# EAGLE design starTrekChair (EAGLE 6.6.0)
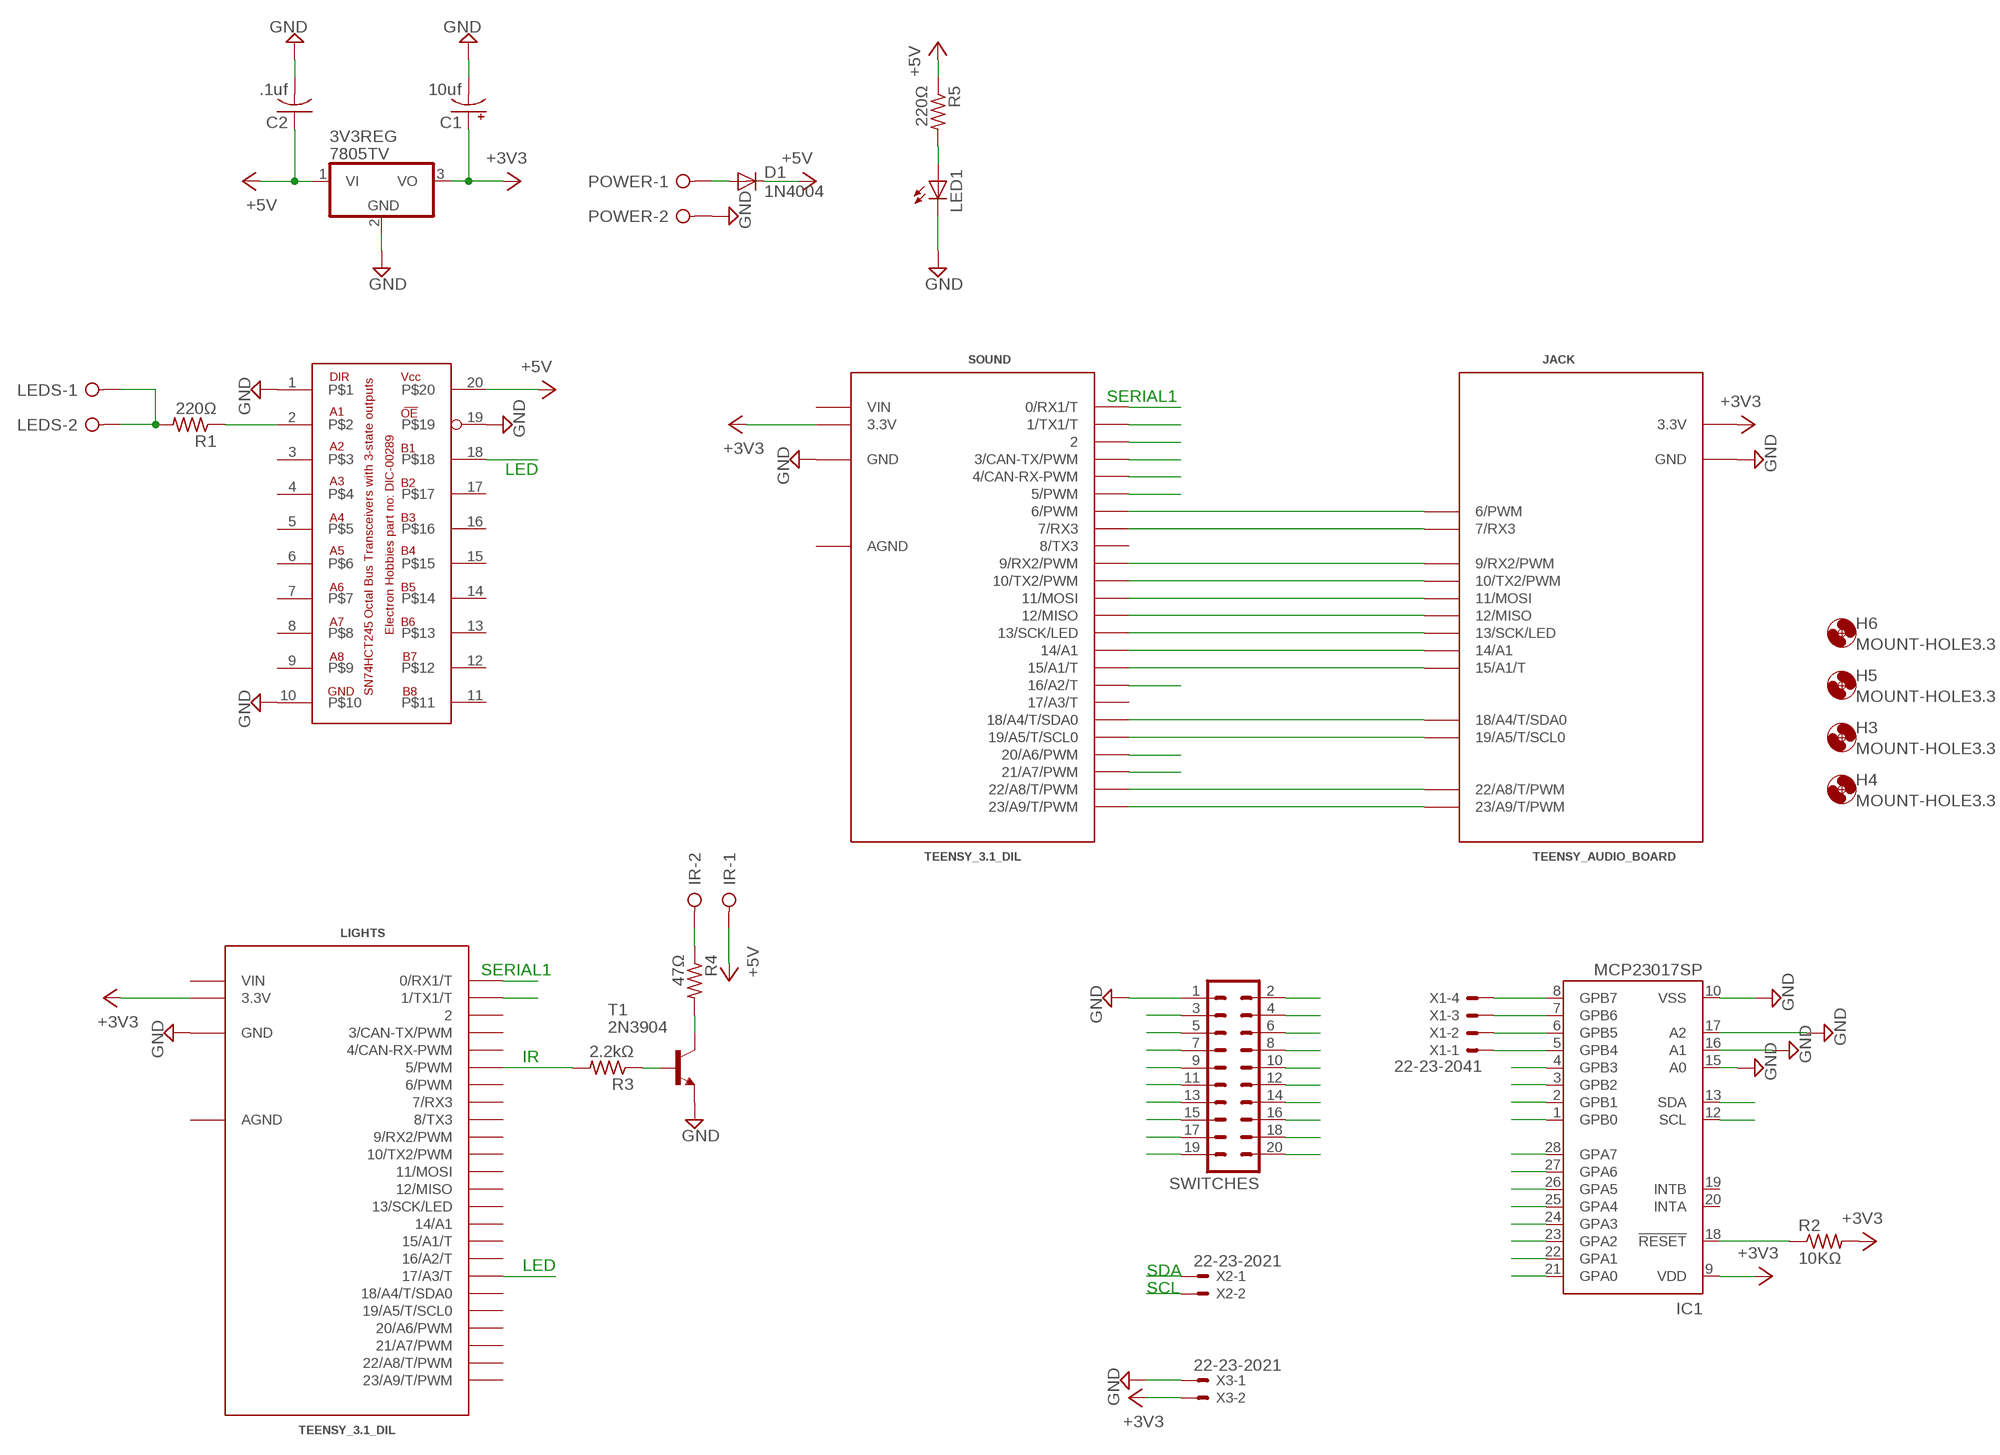
[diagram p0: schematic, sheet 1]

## Parts
3V3REG  7805TV  [TO220V]
C1  10uf  CPOL-USE2-4  [E2-4]
C2  .1uf  C-US050-025X075  [C050-025X075]
D1  1N4004  [DO41-10]
H3  MOUNT-HOLE3.3  [3,3]
H4  MOUNT-HOLE3.3  [3,3]
H5  MOUNT-HOLE3.3  [3,3]
H6  MOUNT-HOLE3.3  [3,3]
IC1  MCP23017SP  [DIL28-3]
IR  W237-02P  [W237-132]
JACK  TEENSY_AUDIO_BOARD  [TEENSY_AUDIO_BOARD]
LED1  LED5MM  [LED5MM]
LEDS  W237-02P  [W237-132]
LIGHTS  TEENSY_3.1_DIL  [TEENSY3-DIL]
POWER  W237-02P  [W237-132]
R1  220Ω  R-US_0207/10  [0207/10]
R2  10KΩ  R-US_0207/10  [0207/10]
R3  2.2kΩ  R-US_0207/10  [0207/10]
R4  47Ω  R-US_0207/10  [0207/10]
R5  220Ω  R-US_0207/10  [0207/10]
SOUND  TEENSY_3.1_DIL  [TEENSY3-DIL]
SWITCHES  ML20  [ML20]
T1  2N3904  [TO92]
U$1  SN74HCT245DIL20  [DIL20]
X1  22-23-2041  [22-23-2041]
X2  22-23-2021  [22-23-2021]
X3  22-23-2021  [22-23-2021]

## Nets
+3V3 [3V3]: 3V3REG.3(VO) C1.+ IC1.9(VDD) JACK.3.3V LIGHTS.3.3V R2.2 SOUND.3.3V X3.2
+5V [+5V]: 3V3REG.1(VI) C2.1 D1.C IR.1 R5.1 U$1.20
GND [GND]: 3V3REG.2(GND) C1.- C2.2 IC1.10(VSS) IC1.15(A0) IC1.16(A1) IC1.17(A2) JACK.GND LED1.K(C) LIGHTS.GND POWER.2 SOUND.GND SWITCHES.1 T1.3(E) U$1.1 U$1.10 U$1.19 X3.1
LED: LIGHTS.17/A3(17/A3/T) U$1.18
N$1: JACK.6(6/PWM) SOUND.6(6/PWM)
N$2: JACK.7(7/RX3) SOUND.7(7/RX3)
N$3: JACK.12(12/MISO) SOUND.12(12/MISO)
N$4: JACK.11(11/MOSI) SOUND.11(11/MOSI)
N$5: JACK.10(10/TX2/PWM) SOUND.10(10/TX2/PWM)
N$6: JACK.9(9/RX2/PWM) SOUND.9(9/RX2/PWM)
N$7: JACK.23/A9(23/A9/T/PWM) SOUND.23/A9(23/A9/T/PWM)
N$8: JACK.22/A8(22/A8/T/PWM) SOUND.22/A8(22/A8/T/PWM)
N$9: IC1.18(!RESET) R2.1
N$10: LIGHTS.5(5/PWM) R3.2
N$11: JACK.15/A1(15/A1/T) SOUND.15/A1(15/A1/T)
N$12: JACK.14/A0(14/A1) SOUND.14/A0(14/A1)
N$13: JACK.13(13/SCK/LED) SOUND.13(13/SCK/LED)
N$14: R1.1 U$1.2
N$15: LEDS.1 LEDS.2 R1.2
N$16: IR.2 R4.1
N$17: R4.2 T1.1(C)
N$18: IC1.5(GPB4) X1.1
N$19: IC1.6(GPB5) X1.2
N$20: IC1.7(GPB6) X1.3
N$21: IC1.8(GPB7) X1.4
N$22: R3.1 T1.2(B)
N$23 [+5V]: LED1.A R5.2
N$24 [+5V]: D1.A POWER.1
RIBBON2: SOUND.2 SWITCHES.2
RIBBON3: SOUND.3(3/CAN-TX/PWM) SWITCHES.3
RIBBON4: SOUND.4(4/CAN-RX-PWM) SWITCHES.4
RIBBON5: SOUND.5(5/PWM) SWITCHES.5
RIBBON6: SOUND.16/A2(16/A2/T) SWITCHES.6
RIBBON7: SOUND.20/A6(20/A6/PWM) SWITCHES.7
RIBBON8: SOUND.21/A7(21/A7/PWM) SWITCHES.8
RIBBON9: IC1.21(GPA0) SWITCHES.9
RIBBON10: IC1.22(GPA1) SWITCHES.10
RIBBON11: IC1.23(GPA2) SWITCHES.11
RIBBON12: IC1.24(GPA3) SWITCHES.12
RIBBON13: IC1.25(GPA4) SWITCHES.13
RIBBON14: IC1.26(GPA5) SWITCHES.14
RIBBON15: IC1.27(GPA6) SWITCHES.15
RIBBON16: IC1.28(GPA7) SWITCHES.16
RIBBON17: IC1.1(GPB0) SWITCHES.17
RIBBON18: IC1.2(GPB1) SWITCHES.18
RIBBON19: IC1.3(GPB2) SWITCHES.19
RIBBON20: IC1.4(GPB3) SWITCHES.20
S_RX: LIGHTS.1(1/TX1/T) SOUND.0(0/RX1/T)
S_TX: LIGHTS.0(0/RX1/T) SOUND.1(1/TX1/T)
SCL: IC1.12(SCL) JACK.19/A5(19/A5/T/SCL0) SOUND.19/A5(19/A5/T/SCL0) X2.2
SDA: IC1.13(SDA) JACK.18/A4(18/A4/T/SDA0) SOUND.18/A4(18/A4/T/SDA0) X2.1
Unconnected: IC1.19(INTB) IC1.20(INTA) LIGHTS.2 LIGHTS.3(3/CAN-TX/PWM) LIGHTS.4(4/CAN-RX-PWM) LIGHTS.6(6/PWM) LIGHTS.7(7/RX3) LIGHTS.8(8/TX3) LIGHTS.9(9/RX2/PWM) LIGHTS.10(10/TX2/PWM) LIGHTS.11(11/MOSI) LIGHTS.12(12/MISO) LIGHTS.13(13/SCK/LED) LIGHTS.14/A0(14/A1) LIGHTS.15/A1(15/A1/T) LIGHTS.16/A2(16/A2/T) LIGHTS.18/A4(18/A4/T/SDA0) LIGHTS.19/A5(19/A5/T/SCL0) LIGHTS.20/A6(20/A6/PWM) LIGHTS.21/A7(21/A7/PWM) LIGHTS.22/A8(22/A8/T/PWM) LIGHTS.23/A9(23/A9/T/PWM) SOUND.8(8/TX3) SOUND.17/A3(17/A3/T) U$1.3 U$1.4 U$1.5 U$1.6 U$1.7 U$1.8 U$1.9 U$1.11 U$1.12 U$1.13 U$1.14 U$1.15 U$1.16 U$1.17

## Notes on the sheet
- SERIAL1
- LED
- SERIAL1
- IR
- LED
- SDA
- SCL

## Power pins joined to a net without a drawn wire
AGND: LIGHTS.AGND SOUND.AGND
VIN: LIGHTS.VIN SOUND.VIN

## Library data of the parts
3V3REG = linear:78*: Positive VOLTAGE REGULATOR Source: http://cache.national.com/ds/LM/LM78L05.pdf http://www.fairchildsemi.com/ds/LM/LM7805.pdf
C1 = adafruit:CPOL-US: POLARIZED CAPACITOR, American symbol
C2 = adafruit:C-US: CAPACITOR, American symbol
D1 = adafruit:1N4004: DIODE General purpose 1N400x type rectifier (With bigger pads) http://www.ladyada.net/library/pcb/eaglelibrary.html
H3-H6 = holes:MOUNT-HOLE: MOUNTING HOLE with drill center marker
IC1 = adafruit:MCP23017: http://ww1.microchip.com/downloads/en/DeviceDoc/21952a.pdf Source: http://ww1.microchip.com/downloads/en/DeviceDoc/21952a.pdf
IR LEDS POWER = con-wago-508:W237-02P: WAGO SREW CLAMP; OC_FARNELL: unknown; OC_NEWARK: unknown
JACK = Teensy_3_and_LC_Series_Boards_v1.1:TEENSY_AUDIO_BOARD: Teensy Audio Board (Shared pins only)
LED1 = adafruit:LED: LED OSRAM: - CHIPLED LG R971, LG N971, LY N971, LG Q971, LY Q971, LO R971, LY R971 LH N974, LH R974 LS Q976, LO Q976, LY Q976 LO Q996 - Hyper CHIPLED LW Q18S LB Q993, LB Q99A, LB R99A - SideLED LS A670, LO A670, LY A670, LG A670, LP A670 LB A673, LV A673, LT A673, LW A673 LH A674 LY A675 LS A676, LA A676, LO A676, LY A676, LW A676 LS A679, LY A679, LG A679 - Hyper Micro SIDELED® LS Y876, LA Y876, LO Y876, LY Y876 LT Y87S - SmartLED LW L88C, LW L88S LB L89C, LB L89S, LG L890 LS L89K, LO L89K, LY L89K LS L896, LA L896, LO L896, LY L896 - TOPLED LS T670, LO T670, LY T670, LG T670, LP T670 LSG T670, LSP T670, LSY T670, LOP T670, LYG T670 LG T671, LOG T671, LSG T671 LB T673, LV T673, LT T673, LW T673 LH T674 LS T676, LA T676, LO T676, LY T676, LB T676, LH T676, LSB T676, LW T676 LB T67C, LV T67C, LT T67C, LS T67K, LO T67K, LY T67K, LW E67C LS E67B, LA E67B, LO E67B, LY E67B, LB E67C, LV E67C, LT E67C LW T67C LS T679, LY T679, LG T679 LS T770, LO T770, LY T770, LG T770, LP T770 LB T773, LV T773, LT T773, LW T773 LH T774 LS E675, LA E675, LY E675, LS T675 LS T776, LA T776, LO T776, LY T776, LB T776 LHGB T686 LT T68C, LB T68C - Hyper Mini TOPLED® LB M676 - Mini TOPLED Santana® LG M470 LS M47K, LO M47K, LY M47K Source: http://www.osram.convergy.de/
LIGHTS SOUND = Teensy_3_and_LC_Series_Boards_v1.1:TEENSY_3.1_DIL: Teensy 3.1 or 3.2 in a DIL Layout.
R1-R5 = adafruit:R-US_: RESISTOR, American symbol
SWITCHES = con-harting-ml:ML20: HARTING; OC_FARNELL: unknown; OC_NEWARK: unknown
T1 = transistor:2N3904: NPN TRANSISTOR
U$1 = EH DIC-00289 - SN74HCT245 OCTAL BUS TRANSCEIVERS WITH 3-STATE OUTPUTS:SN74HCT245: Electron Hobbies DIC-00289 SN74HCT245 Octal Bus Transceivers with 3-state outputs The SN74HCT245 octal bus transceivers are designed for asynchronous two-way communication between data buses. The control-function implementation minimizes external timing requirements. Ideal as an interface between 3.3V logic and the NeoPixel RGB LED's Re-order URL: http://electronhobbies.com/integrated-circuits-ic-s/289-sn74hct245-octal-bus-transceivers-with-3-state-outputs.html Manufacturer: Texas Instruments Manufacturer part number: SN74HCT245N Description: These octal bus transceivers are designed for asynchronous two-way communication between data buses. The control-function implementation minimizes external timing requirements. The ’HCT245 devices allow data transmission from the A bus to the B bus or from the B bus to the A bus, depending upon the logic level at the direction-control (DIR) input. The output-enable (OE) input can be used to disable the device so that the buses are effectively isolated. Features: Operating Voltage Range of 4.5V to 5.5V High Current 3-State Outputs drive bus lines directly or up to 15 LSTTL loads Low power consumption, 80uA Max Icc Typical tpd = 14ns +/- 6mA Output drive at 5V Low input current of 1uA max Inputs are TTL voltage compatible Package type: 20 pin PDIP Package marking SN74HCT245N
X1 = con-molex:22-23-2041: .100" (2.54mm) Center Header - 4 Pin; MF: MOLEX; MPN: 22-23-2041; OC_FARNELL: 1462920; OC_NEWARK: 38C0355
X2 X3 = con-molex:22-23-2021: .100" (2.54mm) Center Header - 2 Pin; MF: MOLEX; MPN: 22-23-2021; OC_FARNELL: 1462926; OC_NEWARK: 25C3832

## Net classes
1 GND: width 0.61 mm, clearance 0.305 mm
2 3V3: width 0.61 mm, clearance 0.305 mm
3 +5V: width 0.61 mm, clearance 0.305 mm

## Board
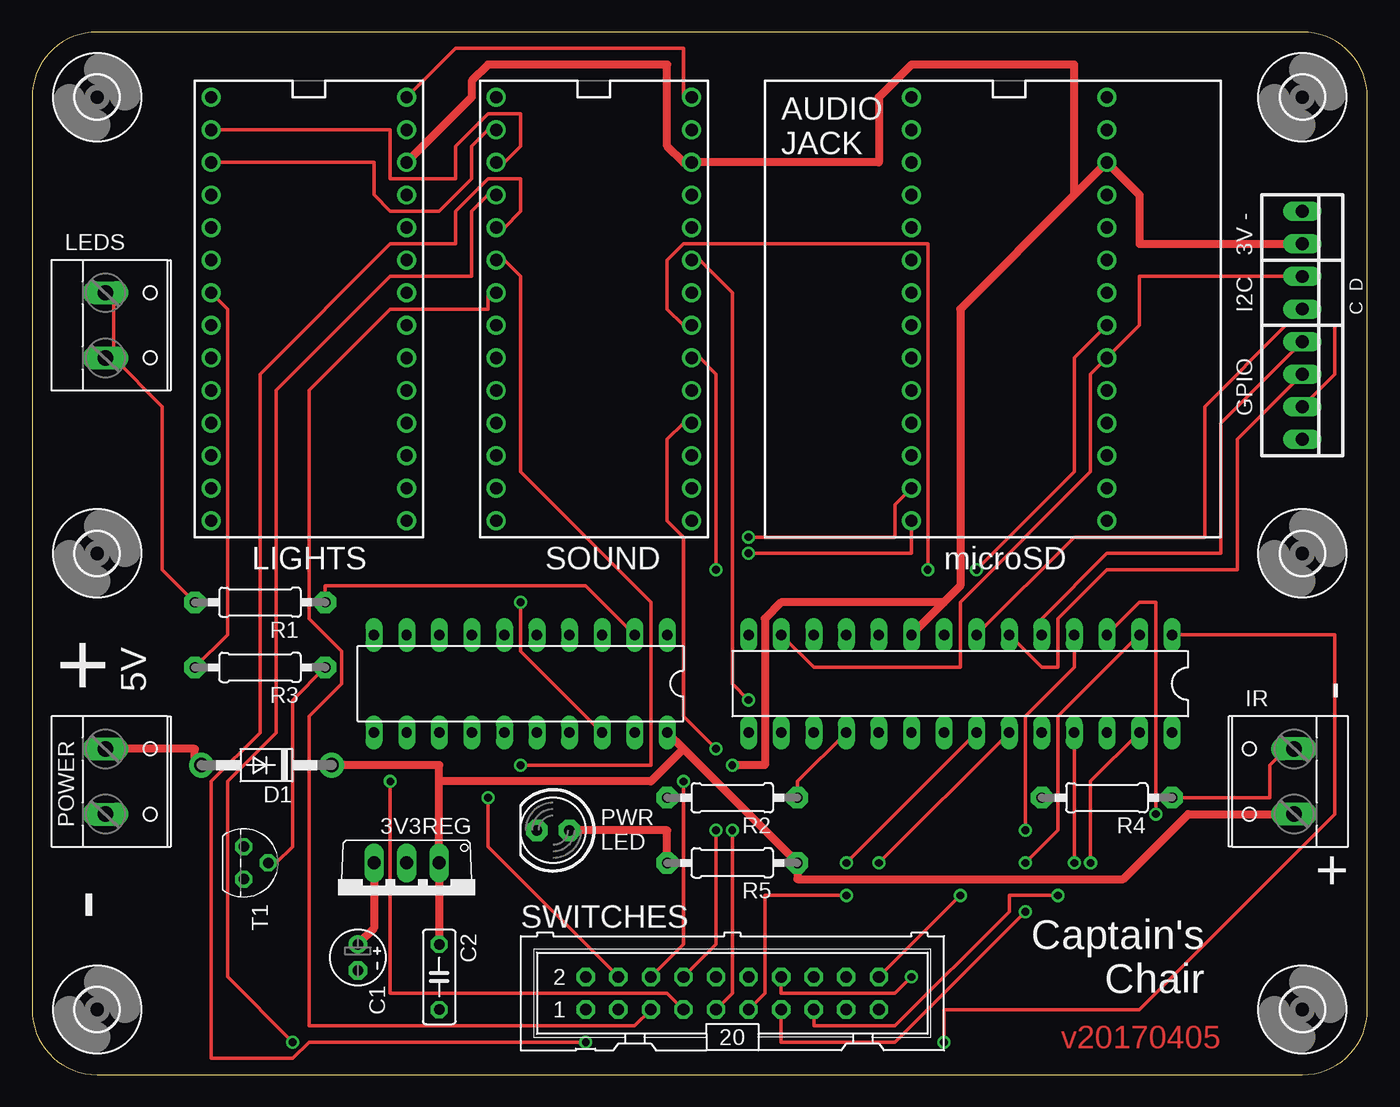
[diagram p1: board, top side]
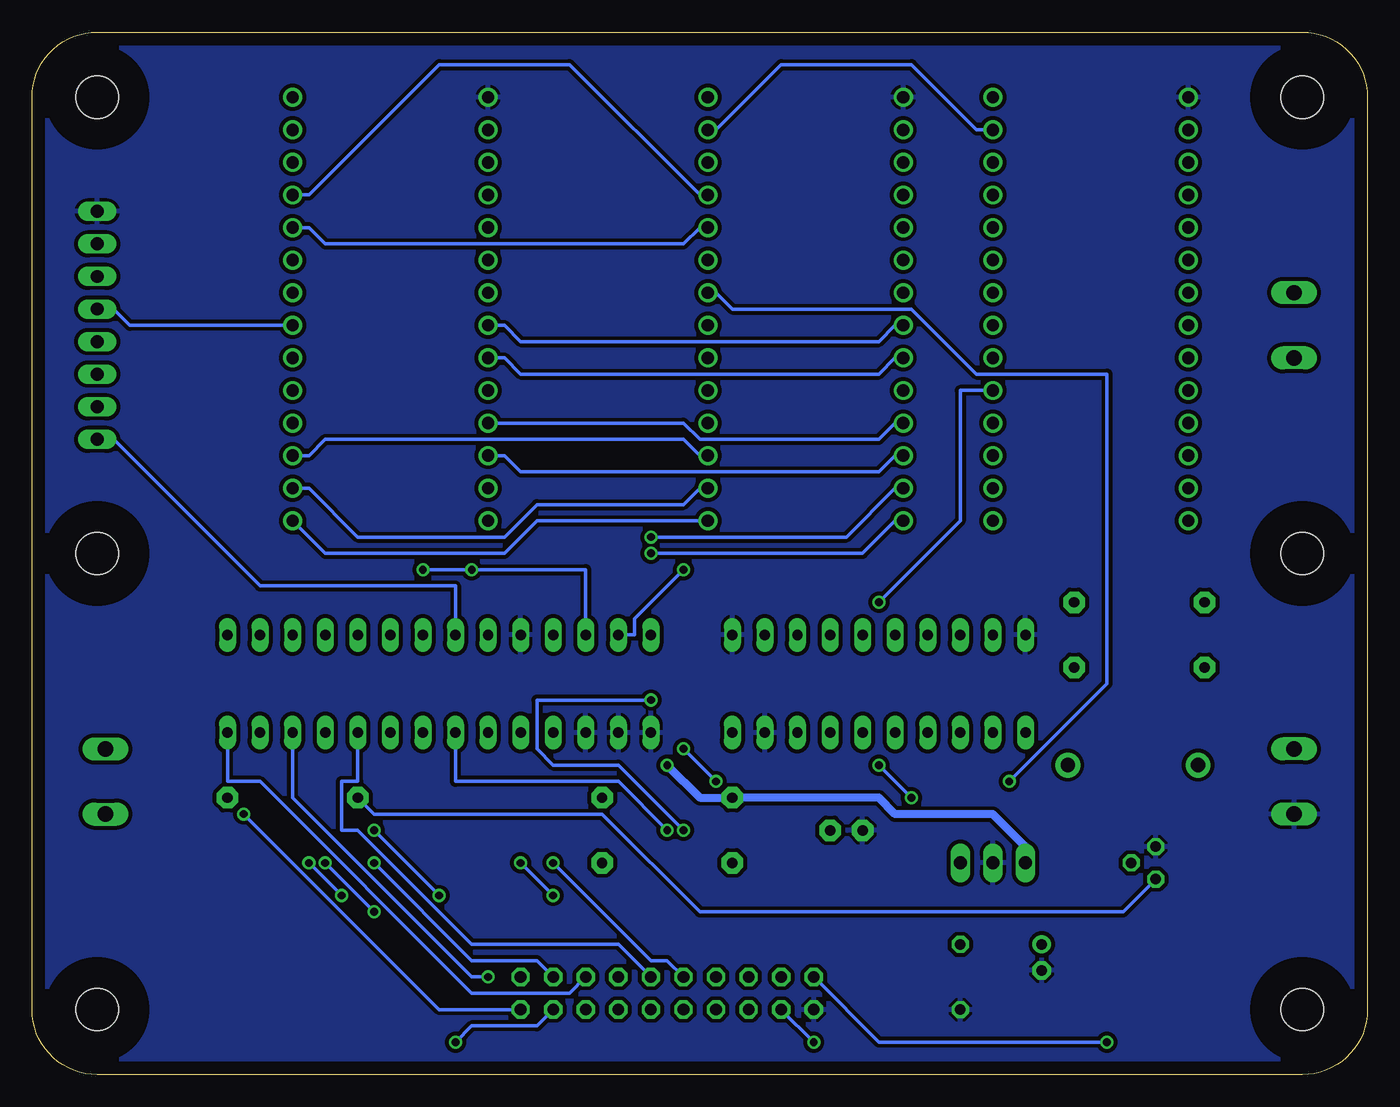
[diagram p2: board, bottom side, seen from below]

Size 104.14 x 81.28 mm. Coordinates in mm from the lower left corner, seen from the top.
Outline: 5.08,0 99.06,0 arc90 104.14,5.08 104.14,76.2 arc90 99.06,81.28 5.08,81.28 arc90 0,76.2 0,5.08 arc90 5.08,0
Copper layers (1*16): Top 0.035mm / dielectric 1.5mm / Bottom 0.035mm
Design rules "default": minimum track width 10mil, minimum drill 24mil, track to track 8mil, track to pad 8mil, pad to pad 8mil, via to via 8mil, smd to smd 8mil, copper to edge 40mil, drill to drill 8mil, minimum pad ring 10mil, minimum via ring 8mil, stop-mask expansion 4mil, vias tented up to drill 0mil, thermal gap 10mil

### Footprints (pad centres in the part's own frame; a part is rotated, then mirrored left to right if it is on the bottom)
TO220V = drill 1.016 long: 1 -2.54,-2.54; 2 0,-2.54; 3 2.54,-2.54
E2-4 = drill 0.813 pad 1.422: + -1.016,0 | drill 0.813 pad 1.422 octagon: - 1.016,0
C050-025X075 = drill 0.813 octagon: 1 -2.54,0; 2 2.54,0
DO41-10 = drill 1.118 pad 1.93: A 5.08,0; C -5.08,0
3,3 = hole 3.3: 0,0
DIL28-3 = drill 0.813 long: 1 -16.51,-3.81; 2 -13.97,-3.81; 3 -11.43,-3.81; 4 -8.89,-3.81; 5 -6.35,-3.81; 6 -3.81,-3.81; 7 -1.27,-3.81; 8 1.27,-3.81; 9 3.81,-3.81; 10 6.35,-3.81; 11 8.89,-3.81; 12 11.43,-3.81; 13 13.97,-3.81; 14 16.51,-3.81; 15 16.51,3.81; 16 13.97,3.81; 17 11.43,3.81; 18 8.89,3.81; 19 6.35,3.81; 20 3.81,3.81; 21 1.27,3.81; 22 -1.27,3.81; 23 -3.81,3.81; 24 -6.35,3.81; 25 -8.89,3.81; 26 -11.43,3.81; 27 -13.97,3.81; 28 -16.51,3.81
W237-132 = drill 1.194 long: 1 -2.54,-0.635; 2 2.54,-0.635
TEENSY_AUDIO_BOARD = drill 0.965: 0 -7.62,13.97; 1 -7.62,11.43; 2 -7.62,8.89; 3 -7.62,6.35; 3.3V 7.62,11.43; 4 -7.62,3.81; 5 -7.62,1.27; 6 -7.62,-1.27; 7 -7.62,-3.81; 8 -7.62,-6.35; 9 -7.62,-8.89; 10 -7.62,-11.43; 11 -7.62,-13.97; 12 -7.62,-16.51; 13 7.62,-16.51; 14/A0 7.62,-13.97; 15/A1 7.62,-11.43; 16/A2 7.62,-8.89; 17/A3 7.62,-6.35; 18/A4 7.62,-3.81; 19/A5 7.62,-1.27; 20/A6 7.62,1.27; 21/A7 7.62,3.81; 22/A8 7.62,6.35; 23/A9 7.62,8.89; AGND 7.62,13.97; GND -7.62,16.51; VIN 7.62,16.51
LED5MM = drill 0.813 pad 1.676 octagon: A -1.27,0; K 1.27,0
TEENSY3-DIL = drill 0.965: 0 -7.62,13.97; 1 -7.62,11.43; 2 -7.62,8.89; 3 -7.62,6.35; 3.3V 7.62,11.43; 4 -7.62,3.81; 5 -7.62,1.27; 6 -7.62,-1.27; 7 -7.62,-3.81; 8 -7.62,-6.35; 9 -7.62,-8.89; 10 -7.62,-11.43; 11 -7.62,-13.97; 12 -7.62,-16.51; 13 7.62,-16.51; 14/A0 7.62,-13.97; 15/A1 7.62,-11.43; 16/A2 7.62,-8.89; 17/A3 7.62,-6.35; 18/A4 7.62,-3.81; 19/A5 7.62,-1.27; 20/A6 7.62,1.27; 21/A7 7.62,3.81; 22/A8 7.62,6.35; 23/A9 7.62,8.89; AGND 7.62,13.97; GND -7.62,16.51; VIN 7.62,16.51
0207/10 = drill 0.813 pad 1.676 octagon: 1 -5.08,0; 2 5.08,0
ML20 = drill 0.914 octagon: 1 -11.43,-1.27; 2 -11.43,1.27; 3 -8.89,-1.27; 4 -8.89,1.27; 5 -6.35,-1.27; 6 -6.35,1.27; 7 -3.81,-1.27; 8 -3.81,1.27; 9 -1.27,-1.27; 10 -1.27,1.27; 11 1.27,-1.27; 12 1.27,1.27; 13 3.81,-1.27; 14 3.81,1.27; 15 6.35,-1.27; 16 6.35,1.27; 17 8.89,-1.27; 18 8.89,1.27; 19 11.43,-1.27; 20 11.43,1.27
TO92 = drill 0.813 octagon: 1 1.27,0; 2 0,1.905; 3 -1.27,0
DIL20 = drill 0.813 long: 1 -11.43,-3.81; 2 -8.89,-3.81; 3 -6.35,-3.81; 4 -3.81,-3.81; 5 -1.27,-3.81; 6 1.27,-3.81; 7 3.81,-3.81; 8 6.35,-3.81; 9 8.89,-3.81; 10 11.43,-3.81; 11 11.43,3.81; 12 8.89,3.81; 13 6.35,3.81; 14 3.81,3.81; 15 1.27,3.81; 16 -1.27,3.81; 17 -3.81,3.81; 18 -6.35,3.81; 19 -8.89,3.81; 20 -11.43,3.81
22-23-2041 = drill 1 long: 1 -3.81,0; 2 -1.27,0; 3 1.27,0; 4 3.81,0
22-23-2021 = drill 1 long: 1 -1.27,0; 2 1.27,0

### Placement (x,y rotation side)
3V3REG  29.21,13.97 180 top
C1  25.4,9.14 270 top
C2  31.75,7.62 270 top
D1  18.29,24.13 180 top
H1  MOUNT-HOLE3.3  [3,3]  5.08,76.2 0 top
H2  MOUNT-HOLE3.3  [3,3]  99.06,76.2 0 top
H3  5.08,5.08 0 top
H4  99.06,5.08 0 top
H5  99.06,40.64 0 top
H6  5.08,40.64 0 top
IC1  72.39,30.48 180 top
IR  97.79,22.86 90 top
JACK  76.2,59.69 0 top
LED1  40.64,19.05 180 top
LEDS  6.35,58.42 270 top
LIGHTS  21.59,59.69 0 top
POWER  6.35,22.86 270 top
R1  17.78,36.83 180 top
R2  54.61,21.59 180 top
R3  17.78,31.75 180 top
R4  83.82,21.59 180 top
R5  54.61,16.51 180 top
SOUND  43.81,59.69 0 top
SWITCHES  54.61,6.35 0 top
T1  16.51,16.51 270 top
U$1  38.1,30.48 180 top
X1  99.06,53.34 270 top
X2  99.06,60.96 270 top
X3  99.06,66.04 270 top

### Tracks (layer width: path | path; a pad name or v marks a point on that pad's centre or on a via)
+3V3  (via drill 0.61)
  Top 0.61: C1.+ 26.67,11.43 3V3REG.3 | LIGHTS.3.3V 34.29,76.2 34.29,77.47 35.56,78.74 49.53,78.74 49.53,72.39 50.8,71.12 SOUND.3.3V 66.04,71.12 66.04,76.2 68.58,78.74 81.28,78.74 81.28,68.58 | 71.12,36.83 72.39,38.1 72.39,59.69 81.28,68.58 | 71.12,36.83 IC1.9 | 81.28,68.58 JACK.3.3V 86.36,68.58 86.36,64.77 X3.2 | v54.61,24.13 57.15,24.13 57.15,35.56 58.42,36.83 71.12,36.83
  Bottom 0.61: 3V3REG.3 26.67,17.78 29.21,20.32 36.83,20.32 38.1,21.59 R2.2 52.07,21.59 v54.61,24.13
+5V
  Top 0.61: C2.1 3V3REG.1 31.75,22.86 | D1.C 31.75,24.13 31.75,22.86 | 50.8,25.4 R5.1 59.69,15.24 85.09,15.24 90.17,20.32 IR.1 | 50.8,25.4 U$1.20 | 31.75,22.86 48.26,22.86 50.8,25.4
AGND
  Bottom 0.254: LIGHTS.AGND 30.48,73.66 35.56,78.74 45.72,78.74 50.8,73.66 SOUND.AGND
GND
  pour Bottom: -2.54,83.82 106.68,83.82 106.68,82.55 106.68,-2.54 -2.54,-2.54
LED  (via drill 0.61)
  Top 0.254: U$1.18 38.1,33.02 v38.1,36.83
  Bottom 0.254: v38.1,36.83 31.75,43.18 31.75,53.34 LIGHTS.17/A3
N$1
  Bottom 0.254: JACK.6 67.31,58.42 66.04,57.15 38.1,57.15 36.83,58.42 SOUND.6
N$2
  Bottom 0.254: JACK.7 67.31,55.88 66.04,54.61 38.1,54.61 36.83,55.88 SOUND.7
N$3  (via drill 0.61)
  Top 0.254: v55.88,40.64 68.58,40.64 JACK.12
  Bottom 0.254: v55.88,40.64 39.37,40.64 36.83,43.18 SOUND.12
N$4  (via drill 0.61)
  Top 0.254: v55.88,41.91 67.31,41.91 67.31,44.45 JACK.11
  Bottom 0.254: v55.88,41.91 40.64,41.91 36.83,45.72 SOUND.11
N$5
  Bottom 0.254: JACK.10 67.31,48.26 66.04,46.99 38.1,46.99 36.83,48.26 SOUND.10
N$6
  Bottom 0.254: JACK.9 53.34,50.8 52.07,49.53 38.1,49.53 36.83,50.8 SOUND.9
N$7
  Bottom 0.254: JACK.23/A9 82.55,68.58 72.39,78.74 62.23,78.74 52.07,68.58 SOUND.23/A9
N$8
  Bottom 0.254: JACK.22/A8 82.55,66.04 81.28,64.77 53.34,64.77 52.07,66.04 SOUND.22/A8
N$9
  Top 0.254: IC1.18 59.69,22.86 R2.1
N$10
  Top 0.254: LIGHTS.5 15.24,59.69 15.24,34.29 R3.2
N$11
  Bottom 0.254: JACK.15/A1 82.55,48.26 81.28,49.53 53.34,49.53 52.07,48.26 SOUND.15/A1
N$12
  Bottom 0.254: JACK.14/A0 82.55,45.72 78.74,41.91 67.31,41.91 64.77,44.45 53.34,44.45 52.07,45.72 SOUND.14/A0
N$13
  Bottom 0.254: SOUND.13 64.77,43.18 67.31,40.64 81.28,40.64 JACK.13
N$14
  Top 0.254: U$1.2 43.18,38.1 22.86,38.1 R1.1
N$15
  Top 0.254: R1.2 10.16,39.37 10.16,52.07 6.35,55.88 | 6.35,55.88 6.35,60.96 LEDS.1 | 6.35,55.88 LEDS.2
N$16
  Top 0.254: R4.1 96.52,21.59 96.52,24.13 97.79,25.4 IR.2
N$17
  Bottom 0.254: T1.1 19.05,12.7 52.07,12.7 59.69,20.32 77.47,20.32 R4.2
N$18
  Top 0.254: IC1.5 78.74,35.56 83.82,40.64 92.71,40.64 92.71,50.8 X1.1
N$19
  Top 0.254: IC1.6 78.74,31.75 80.01,31.75 80.01,35.56 83.82,39.37 93.98,39.37 93.98,49.53 X1.2
N$20
  Top 0.254: IC1.7 81.28,41.91 91.44,41.91 91.44,52.07 97.79,58.42 101.6,58.42 101.6,54.61 X1.3
N$21
  Bottom 0.254: IC1.8 71.12,38.1 86.36,38.1 97.79,49.53 X1.4
N$22
  Top 0.254: R3.1 20.32,29.21 20.32,17.78 19.05,16.51 T1.2
N$23
  Top 0.61: LED1.A 49.53,19.05 R5.2
N$24
  Top 0.61: POWER.1 12.7,25.4 12.7,24.13 D1.A
RIBBON2  (via drill 0.61)
  Top 0.254: v20.32,2.54 15.24,7.62 15.24,22.86 19.05,26.67 19.05,53.34 27.94,62.23 34.29,62.23 34.29,67.31 35.56,68.58 SOUND.2
  Bottom 0.254: SWITCHES.2 38.1,2.54 v20.32,2.54
RIBBON3  (via drill 0.61)
  Top 0.254: v43.18,2.54 21.59,2.54 20.32,1.27 13.97,1.27 13.97,22.86 17.78,26.67 17.78,54.61 27.94,64.77 33.02,64.77 33.02,67.31 35.56,69.85 38.1,69.85 38.1,67.31 36.83,66.04 SOUND.3
  Bottom 0.254: v43.18,2.54 SWITCHES.3
RIBBON4  (via drill 0.61)
  Top 0.254: SWITCHES.4 35.56,17.78 v35.56,21.59 | v38.1,24.13 48.26,24.13 48.26,36.83 38.1,46.99 38.1,62.23 36.83,63.5 SOUND.4
  Bottom 0.254: v38.1,24.13 v35.56,21.59
RIBBON5
  Top 0.254: SWITCHES.5 46.99,3.81 21.59,3.81 21.59,27.94 24.13,30.48 24.13,33.02 21.59,35.56 21.59,53.34 27.94,59.69 35.56,59.69 35.56,60.96 SOUND.5
RIBBON6  (via drill 0.61)
  Top 0.254: SWITCHES.6 50.8,10.16 v50.8,22.86 | v53.34,25.4 50.8,27.94 50.8,41.91 49.53,43.18 49.53,49.53 50.8,50.8 SOUND.16/A2
  Bottom 0.254: v53.34,25.4 v50.8,22.86
RIBBON7  (via drill 0.61)
  Top 0.254: SWITCHES.7 49.53,6.35 27.94,6.35 v27.94,22.86
  Bottom 0.254: v27.94,22.86 20.32,30.48 20.32,54.61 30.48,54.61 35.56,59.69 49.53,59.69 50.8,60.96 SOUND.20/A6
RIBBON8  (via drill 0.61)
  Top 0.254: SWITCHES.8 53.34,10.16 v53.34,19.05 | v55.88,29.21 54.61,30.48 54.61,60.96 52.07,63.5 SOUND.21/A7
  Bottom 0.254: v53.34,19.05 58.42,24.13 63.5,24.13 64.77,25.4 64.77,29.21 v55.88,29.21
RIBBON9  (via drill 0.61)
  Top 0.254: v54.61,19.05 54.61,6.35 SWITCHES.9
  Bottom 0.254: IC1.21 71.12,22.86 58.42,22.86 v54.61,19.05
RIBBON10  (via drill 0.61)
  Top 0.254: v63.5,16.51 IC1.22
  Bottom 0.254: v63.5,16.51 55.88,8.89 54.61,8.89 SWITCHES.10
RIBBON11  (via drill 0.61)
  Top 0.254: v66.04,16.51 IC1.23 | v63.5,13.97 57.15,13.97 57.15,6.35 SWITCHES.11
  Bottom 0.254: v63.5,13.97 v66.04,16.51
RIBBON12
  Bottom 0.254: IC1.24 78.74,22.86 80.01,22.86 80.01,19.05 78.74,19.05 69.85,10.16 58.42,10.16 SWITCHES.12
RIBBON13  (via drill 0.61)
  Top 0.254: v81.28,16.51 IC1.25 | v77.47,12.7 67.31,2.54 58.42,2.54 SWITCHES.13
  Bottom 0.254: v77.47,12.7 v81.28,16.51
RIBBON14  (via drill 0.61)
  Top 0.254: v68.58,7.62 67.31,6.35 58.42,6.35 SWITCHES.14
  Bottom 0.254: IC1.26 83.82,21.59 69.85,7.62 v68.58,7.62
RIBBON15  (via drill 0.61)
  Top 0.254: IC1.27 82.55,22.86 v82.55,16.51 | v80.01,13.97 76.2,13.97 76.2,12.7 67.31,3.81 60.96,3.81 SWITCHES.15
  Bottom 0.254: v80.01,13.97 v82.55,16.51
RIBBON16
  Bottom 0.254: IC1.28 88.9,22.86 86.36,22.86 69.85,6.35 62.23,6.35 SWITCHES.16
RIBBON17  (via drill 0.61)
  Top 0.254: IC1.1 101.6,34.29 101.6,20.32 86.36,5.08 71.12,5.08 v71.12,2.54
  Bottom 0.254: v71.12,2.54 69.85,3.81 64.77,3.81 SWITCHES.17
RIBBON18  (via drill 0.61)
  Top 0.254: IC1.2 80.01,27.94 80.01,19.05 v77.47,16.51
  Bottom 0.254: v77.47,16.51 69.85,8.89 64.77,8.89 SWITCHES.18
RIBBON19  (via drill 0.61)
  Top 0.254: IC1.3 86.36,36.83 87.63,36.83 v87.63,20.32
  Bottom 0.254: v87.63,20.32 72.39,5.08 SWITCHES.19
RIBBON20  (via drill 0.61)
  Top 0.254: IC1.4 81.28,31.75 77.47,27.94 v77.47,19.05 | SWITCHES.20 v72.39,13.97
  Bottom 0.254: v72.39,13.97 v77.47,19.05
S_RX
  Top 0.254: LIGHTS.1 26.67,71.12 26.67,68.58 27.94,67.31 31.75,67.31 34.29,69.85 34.29,72.39 35.56,73.66 SOUND.0
S_TX
  Top 0.254: LIGHTS.0 27.94,73.66 27.94,69.85 33.02,69.85 33.02,72.39 35.56,74.93 38.1,74.93 38.1,72.39 36.83,71.12 SOUND.1
SCL  (via drill 0.61)
  Top 0.254: v73.66,39.37 81.28,46.99 81.28,55.88 JACK.19/A5 | v69.85,39.37 69.85,64.77 50.8,64.77 49.53,63.5 49.53,59.69 50.8,58.42 SOUND.19/A5
  Bottom 0.254: IC1.12 60.96,39.37 v69.85,39.37 v73.66,39.37 | X2.2 97.79,59.69 96.52,58.42 JACK.19/A5
SDA  (via drill 0.61)
  Top 0.254: IC1.13 60.96,31.75 72.39,31.75 72.39,36.83 82.55,46.99 82.55,54.61 JACK.18/A4 86.36,58.42 86.36,62.23 X2.1 | v53.34,39.37 53.34,54.61 52.07,55.88 SOUND.18/A4
  Bottom 0.254: v53.34,39.37 57.15,35.56 57.15,34.29 IC1.13
VIN
  Top 0.254: LIGHTS.VIN 33.02,80.01 50.8,80.01 50.8,76.2 SOUND.VIN

### Text on the board
Top: v20170405
tNames: AUDIO / JACK | 3V - | I2C | C D | GPIO | microSD | + | 5V | - | PWR / LED | + | - | Captain's / Chair
tStop: v20170405